# EAGLE design dw-probe-v1.0 (EAGLE 9.5.1)
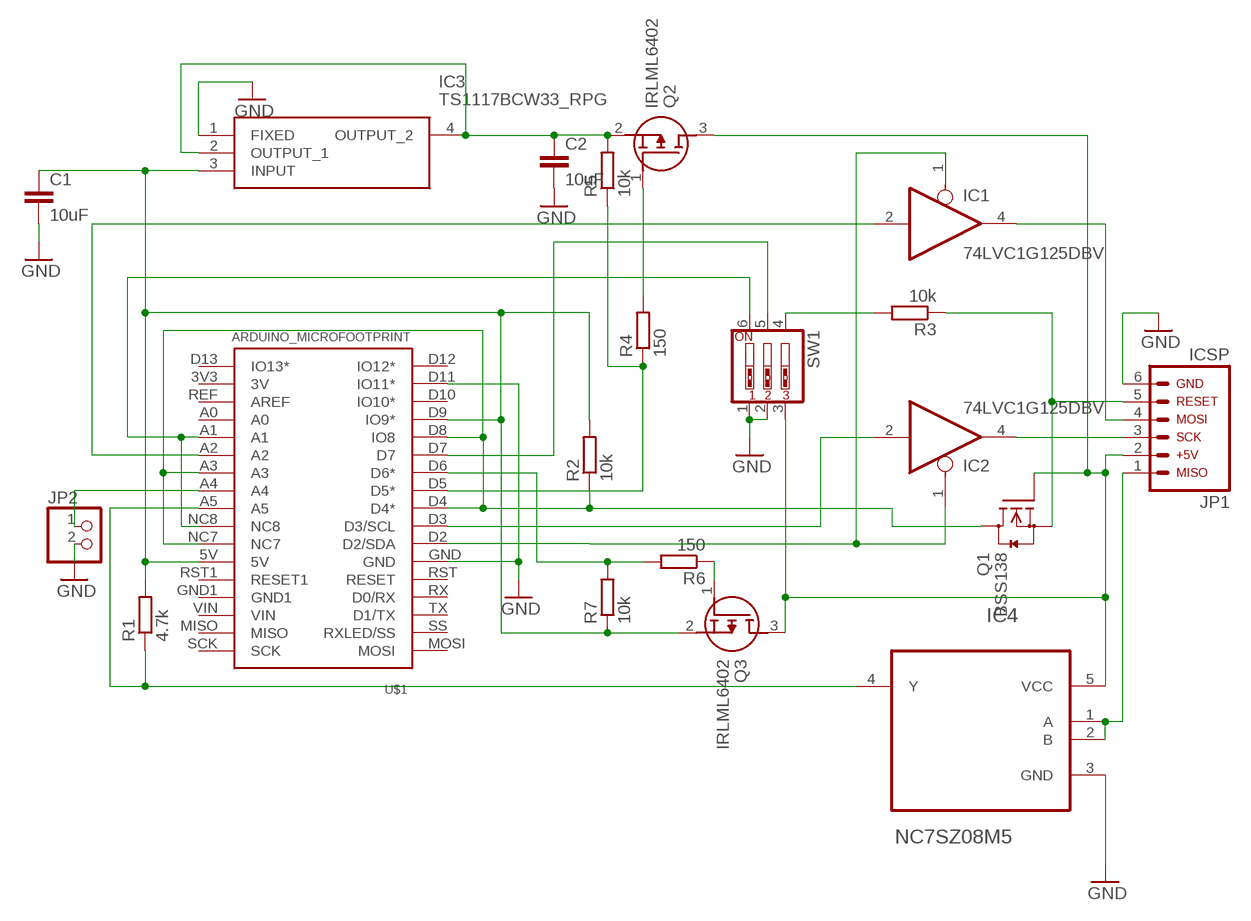
[diagram p0: schematic, sheet 1]

## Parts
C1  10uF  C-EUC0805  [C0805]
C2  10uF  C-EUC0805  [C0805]
IC1  74LVC1G125DBV  [SOT23-5]
IC2  74LVC1G125DBV  [SOT23-5]
IC3  TS1117BCW33_RPG  [SOT230P700X190-4N]
IC4  NC7SZ08M5  [SOT95P280X145-5N]
JP1  ARDUINO_CONN-ICSP  [CONN-2X03]
JP2  PINHD-1X2  [1X02]
Q1  BSS138  [SOT23]
Q2  IRLML6402  [SOT95P237X112-3N]
Q3  IRLML6402  [SOT95P237X112-3N]
R1  4.7k  R-EU_R0805  [R0805]
R2  10k  R-EU_R0805  [R0805]
R3  10k  R-EU_R0805  [R0805]
R4  150  R-EU_R0805  [R0805]
R5  10k  R-EU_R0805  [R0805]
R6  150  R-EU_R0805  [R0805]
R7  10k  R-EU_R0805  [R0805]
SW1  SW_DIP-3  [EDG-03]
U$1  ARDUINO_MICROFOOTPRINT  [ARDUINO-MICRO]

## Nets
GND: C1.2 C2.2 IC3.1(FIXED) IC4.3(GND) JP1.6 JP2.2 SW1.1 SW1.2 U$1.D11(IO11*) U$1.GND
N$1: R3.2 SW1.4
N$2: SW1.6 U$1.A1 U$1.NC8
N$3: IC1.1(OE) IC2.1(OE) U$1.D2(D2/SDA)
N$4: Q1.3(D) R2.1 U$1.A3 U$1.D4(D4*) U$1.D8(IO8) U$1.NC7
N$5: C1.1 IC3.3(INPUT) Q3.2(S) R1.2 R2.2 R7.1 U$1.5V U$1.D9(IO9*)
N$6: IC2.2(I) U$1.D3(D3/SCL)
N$7: IC1.2(I) U$1.A2
N$8: IC4.4(Y) R1.1 U$1.A5
N$9: JP2.1 U$1.A4
N$10: IC1.4(O) JP1.4
N$11: SW1.5 U$1.D7
N$12: IC4.5(VCC) JP1.2 Q1.1(G) Q2.3(D) Q3.3(D) SW1.3
N$13: IC4.1(A) IC4.2(B) JP1.1
N$14: JP1.5 Q1.2(S) R3.1
N$15: Q3.1(G) R6.1
N$16: C2.1 IC3.2(OUTPUT_1) IC3.4(OUTPUT_2) Q2.2(S) R5.2
N$17: IC2.4(O) JP1.3
N$18: R4.1 R5.1 U$1.D5(D5*)
N$19: Q2.1(G) R4.2
N$20: R6.2 R7.2 U$1.D6(D6*)
Unconnected: U$1.3V3(3V) U$1.A0 U$1.D10(IO10*) U$1.D12(IO12*) U$1.D13(IO13*) U$1.GND1 U$1.MISO U$1.MOSI U$1.REF(AREF) U$1.RST1(RESET1) U$1.RST(RESET) U$1.RX(D0/RX) U$1.SCK U$1.SS(RXLED/SS) U$1.TX(D1/TX) U$1.VIN

## Power pins joined to a net without a drawn wire
GND: IC1.3(GND) IC2.3(GND)
VCC: IC1.5(VCC) IC2.5(VCC)

## Library data of the parts
C1 C2 = rcl:C-EU: CAPACITOR, European symbol; SPICEPREFIX: C
IC1 IC2 = 74xx-little-us:74*1G125: Single Bus Buffer Gate with 3-State Output
IC3 = TS1117BCW33_RPG:TS1117BCW33_RPG: Taiwan Semiconductor TS1117BCW33 RPG, LDO Regulator, 800mA, 3.3 V, +/-2% 4-Pin, SOT-223 Source: Datasheet <http://uk.rs-online.com/web/p/products/1698939>; ARROW_PART_NUMBER: TS1117BCW33 RPG; ARROW_PRICE-STOCK: https://www.arrow.com/en/products/ts1117bcw33rpg/taiwan-semiconductor; DESCRIPTION: Taiwan Semiconductor TS1117BCW33 RPG, LDO Regulator, 800mA, 3.3 V, +/-2% 4-Pin, SOT-223; HEIGHT: 1.9mm; MANUFACTURER_NAME: Taiwan Semiconductor; MANUFACTURER_PART_NUMBER: TS1117BCW33 RPG; MOUSER_PART_NUMBER: 821-TS1117BCW33RPG; MOUSER_PRICE-STOCK: https://www.mouser.co.uk/ProductDetail/Taiwan-Semiconductor/TS1117BCW33-RPG?qs=5aG0NVq1C4zdwcJSPRwZGg%3D%3D
IC4 = NC7SZ08M5:NC7SZ08M5: Tiny logic UHS Two-Input AND Gate Check prices <https://pricing.snapeda.com/parts/NC7SZ08M5/ON%20Semiconductor/view-part?ref=eda>; AVAILABILITY: In Stock; DESCRIPTION: AND Gate IC 1 Channel - SOT-23-5; MF: ON Semiconductor; MP: NC7SZ08M5; PACKAGE: SOT-23 Fairchild Semiconductor; PRICE: None
JP1 = arduino_jw:ARDUINO_CONN-ICSP: Arduino ICSP I/O Header This is the ICSP I/O header on the Arduino Uno R3. This connector is labeled with the following pin assignments: MISO +5V SCK MOSI RESET GND NOTE: Be sure you install this connector with the correct orientation on your PCB layout. Pin 1 has a square pad to assist with orientation.
JP2 = pinhead:PINHD-1X2: PIN HEADER
Q1 = m-pad-2.1:BSS138: Fairchild Semiconductors BSS138 N-Channel Logic Level Enhancement Mode Field Effect Transistor General Description: These N-Channel enhancement mode field effect transistors are produced using Fairchild's proprietary, high cell density, DMOS technology. These products have been designed to minimize on-state resistance while provide rugged, reliable, and fast switching performance.These products are particularly suited for low voltage, low current applications such as small servo motor control, power MOSFET gate drivers, and other switching applications. Features: 0.22 A, 50 V. RDS(ON) = 3.5Ohm @ VGS = 10 V RDS(ON) = 6.0Ohm @ VGS = 4.5 V High density cell design for extremely low RDS(ON) Rugged and Reliable Compact industry standard SOT-23 surface mount package Please send any comments to: messi@users.sourceforge.net
Q2 Q3 = IRLML6402:IRLML6402: P-Channel MOSFET Transistor, 3.7 A, 20 V, 3-Pin SOT-23 International Rectifier IRLML6402 Source: Datasheet <https://datasheetspdf.com/pdf/513015/InternationalRectifier/IRLML6402/1>; DESCRIPTION: P-Channel MOSFET Transistor, 3.7 A, 20 V, 3-Pin SOT-23 International Rectifier IRLML6402; HEIGHT: 1.12mm; MANUFACTURER_NAME: Infineon; MANUFACTURER_PART_NUMBER: IRLML6402; MOUSER_PART_NUMBER: N/A; MOUSER_PRICE-STOCK: https://www.mouser.co.uk/ProductDetail/Infineon-IR/IRLML6402/?qs=Gkr2N%2F2q3o277qI%252BRzUP%252Bw%3D%3D
R1-R7 = rcl:R-EU_: RESISTOR, European symbol; SPICEPREFIX: R
SW1 = special:SW_DIP-3: DIP SWITCH
U$1 = arduino-micro:ARDUINO_MICRO

## Board
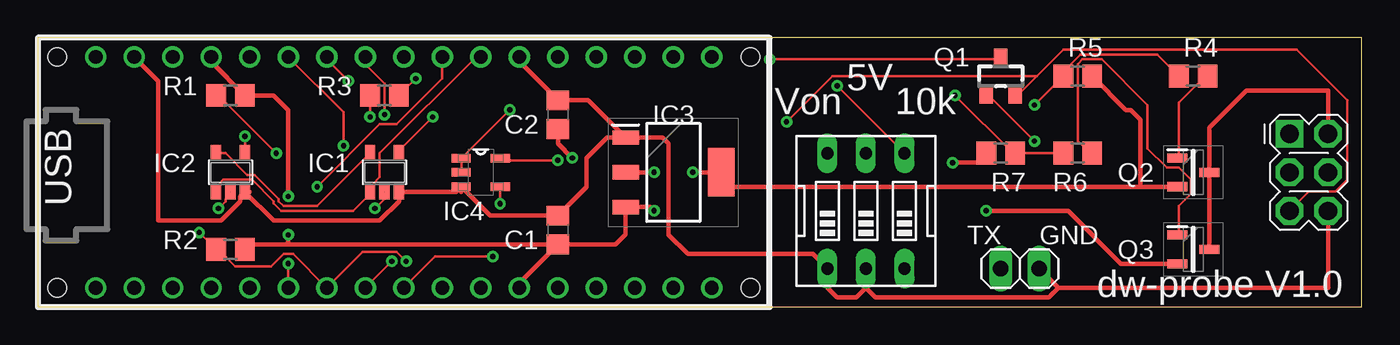
[diagram p1: board, top side]
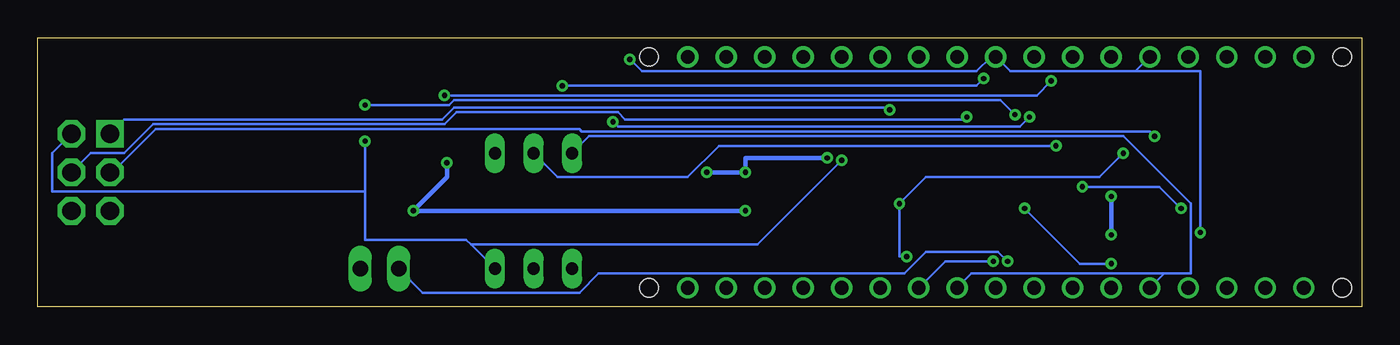
[diagram p2: board, bottom side, seen from below]

Size 87.3 x 17.77 mm. Coordinates in mm from the lower left corner, seen from the top.
Outline: 0,0 87.3,0 87.3,17.77 0,17.77 0,0
Copper layers (1*16): Top 0.035mm / dielectric 1.5mm / Bottom 0.035mm
Design rules "default *": minimum track width 6mil, minimum drill 0.35mm, track to track 6mil, track to pad 6mil, pad to pad 6mil, via to via 6mil, smd to smd 6mil, copper to edge 10mil, drill to drill 6mil, minimum pad ring 10mil, minimum via ring 8mil, stop-mask expansion 4mil, vias tented up to drill 0mil, thermal gap 10mil

### Footprints (pad centres in the part's own frame; a part is rotated, then mirrored left to right if it is on the bottom)
C0805 = smd 1.3 x 1.5: 1 -0.95,0; 2 0.95,0
SOT23-5 = smd 0.69 x 0.99: 1 -0.95,-1.29; 2 0,-1.29; 3 0.95,-1.29; 4 0.95,1.3; 5 -0.95,1.3
SOT230P700X190-4N = smd 1.75 x 0.95: 1 -3.15,2.3; 2 -3.15,0; 3 -3.15,-2.3 | smd 1.75 x 3.2: 4 3.15,0
SOT95P280X145-5N = smd 1.27 x 0.559: 1 -1.295,0.94; 2 -1.295,0; 3 -1.295,-0.94; 4 1.295,-0.94; 5 1.295,0.94
CONN-2X03 = drill 1.2 pad 1.829 square: 1 0,0 | drill 1.2 pad 1.829 octagon: 2 2.54,0; 3 0,-2.54; 4 2.54,-2.54; 5 0,-5.08; 6 2.54,-5.08
1X02 = drill 1.016 long: 1 -1.27,0; 2 1.27,0
SOT23 = smd 0.9 x 1.2: 1 -0.95,-1.2; 2 0.95,-1.2; 3 0,1.2
SOT95P237X112-3N = smd 1.3 x 0.6: 1 -1.05,0.95; 2 -1.05,-0.95; 3 1.05,0
R0805 = smd 1.3 x 1.5: 1 -0.95,0; 2 0.95,0
EDG-03 = drill 0.813 long: 1 -2.54,-3.81; 2 0,-3.81; 3 2.54,-3.81; 4 2.54,3.81; 5 0,3.81; 6 -2.54,3.81
ARDUINO-MICRO = drill 0.9: 3V3 16.51,3.81; 5V 16.51,29.21; A0 16.51,8.89; A1 16.51,11.43; A2 16.51,13.97; A3 16.51,16.51; A4 16.51,19.05; A5 16.51,21.59; D2 1.27,26.67; D3 1.27,24.13; D4 1.27,21.59; D5 1.27,19.05; D6 1.27,16.51; D7 1.27,13.97; D8 1.27,11.43; D9 1.27,8.89; D10 1.27,6.35; D11 1.27,3.81; D12 1.27,1.27; D13 16.51,1.27; GND 1.27,29.21; GND1 16.51,34.29; MISO 16.51,39.37; MOSI 1.27,41.91; NC7 16.51,26.67; NC8 16.51,24.13; REF 16.51,6.35; RST 1.27,31.75; RST1 16.51,31.75; RX 1.27,34.29; SCK 16.51,41.91; SS 1.27,39.37; TX 1.27,36.83; VIN 16.51,36.83 | hole 1.2: 1.27,-1.27; 16.51,-1.27; 1.27,44.45; 16.51,44.45

### Placement (x,y rotation side)
C1  34.29,5.08 90 top
C2  34.29,12.7 90 top
IC1  22.86,8.89 0 top
IC2  12.7,8.89 0 top
IC3  41.91,8.89 0 top
IC4  29.21,8.89 0 top
JP1  82.55,11.43 0 top
JP2  64.77,2.54 0 top
Q1  63.5,15.24 0 top
Q2  76.2,8.89 0 top
Q3  76.2,3.81 0 top
R1  12.7,13.97 0 top
R2  12.7,3.81 0 top
R3  22.86,13.97 0 top
R4  76.2,15.24 0 top
R5  68.58,15.24 0 top
R6  68.58,10.16 180 top
R7  63.5,10.16 0 top
SW1  54.61,6.35 0 top
U$1  2.54,17.78 270 top

### Tracks (layer width: path | path; a pad name or v marks a point on that pad's centre or on a via)
GND
  Top 0.305: 13.97,7.6 IC2.3 | IC2.3 15.54,5.71 22.54,5.71 23.81,6.98 IC1.3 | IC1.3 24.13,7.6 | 27.91,7.6 27.91,7.62 IC4.3 | C1.2 34.29,5.71 | IC3.1 38.76,11.43 IC3.1 | JP1.6 85.09,1.27 67.31,1.27 | JP2.2 67.31,1.27 | 67.31,1.27 66.67,0.64 55.24,0.64 54.61,1.27 | 54.61,1.27 SW1.2 54.61,1.27 | 54.61,1.27 53.98,0.64 52.7,0.64 52.07,1.27 SW1.1 51.12,3.49 42.86,3.49 41.59,4.76 41.59,10.79 41.2,11.19 IC3.1 | U$1.D11 7.94,14.92 7.94,5.71 12.09,5.71 13.35,6.98 13.35,7.3 IC2.3 | IC1.3 27.56,7.6 IC4.3 | IC4.3 29.84,6.03 C1.2 | C1.2 36.2,7.93 36.2,9.84 37.54,11.19 IC3.1 | IC3.1 36.3,13.65 C2.2 31.75,16.19 U$1.GND
N$1  (via drill 0.35)
  Top 0.152: v24.92,15.08 R3.2 | SW1.4 v52.7,14.61
  Bottom 0.152: v24.92,15.08 25.4,14.61 v52.7,14.61
N$2
  Bottom 0.152: SW1.6 50.96,11.27 15.72,11.27 11.27,6.83 11.27,2.22 13.02,2.22 | U$1.A1 13.02,2.22 | U$1.NC8 25.72,2.22 13.02,2.22
N$3
  Top 0.152: IC2.1 11.91,7.62 11.91,8.1 12.22,8.41 14.13,8.41 15.56,6.99 15.56,6.83 16.03,6.35 20.8,6.35 21.91,7.46 IC1.1 22.07,7.62 22.07,8.1 22.54,8.57 22.54,10.16 28.89,16.51 U$1.D2
N$4  (via drill 0.35)
  Top 0.152: v24.29,3.02 23.65,3.65 21.43,3.65 U$1.A3 16.83,3.49 16.19,3.49 15.4,2.7 13.02,2.7 11.91,3.81 R2.1 v10.64,4.92 | v48.26,16.35 63.5,16.35 Q1.3
  Bottom 0.152: U$1.NC7 27.46,3.02 v24.29,3.02 | v48.26,16.35 47.47,15.56 25.4,15.56 24.45,16.51 U$1.D4 23.18,15.56 14.92,15.56 | 14.92,15.56 U$1.D8 | v10.64,4.92 10.64,15.56 14.92,15.56
N$5  (via drill 0.35)
  Top 0.305: C1.1 38.1,4.13 38.76,4.79 IC3.3 40.4,6.59 v40.64,6.35 | C1.1 16.51,4.13 | 16.51,4.13 14.29,4.13 C1.1 | U$1.5V 31.75,1.59 C1.1 | U$1.D9 11.43,16.19 R1.2 15.56,13.97 16.51,13.02 v16.51,7.3 | 16.51,4.13 v16.51,4.76 | R2.2 13.97,4.13 16.51,4.13 | Q3.2 71.44,2.86 67.94,6.35 v62.55,6.35 | R7.1 61.91,9.53 v60.33,9.53
  Bottom 0.305: v16.51,7.3 v16.51,4.76 | v40.64,6.35 v62.55,6.35 60.33,8.57 v60.33,9.53
N$6  (via drill 0.35)
  Top 0.152: v11.91,6.51 12.38,6.99 12.38,7.14 12.7,7.46 IC2.2 | v18.41,7.94 22.54,12.06 23.65,12.06 26.67,15.08 U$1.D3
  Bottom 0.152: v11.91,6.51 13.34,7.94 v18.41,7.94
N$7  (via drill 0.35)
  Top 0.152: v22.23,6.51 22.86,7.14 22.86,7.46 IC1.2 | U$1.A2 v16.51,2.86
  Bottom 0.152: v22.23,6.51 18.57,2.86 v16.51,2.86
N$8  (via drill 0.35)
  Top 0.152: v30.48,6.83 30.48,7.94 IC4.4 | v30,3.33 26.19,3.33 U$1.A5 | v15.72,10.16 11.91,13.97 R1.1
  Bottom 0.152: v30,3.33 30.48,3.33 v30.48,6.83 28.73,8.57 17.3,8.57 v15.72,10.16
N$9  (via drill 0.35)
  Top 0.152: v23.34,3.02 U$1.A4
  Bottom 0.152: v23.34,3.02 23.97,3.65 28.73,3.65 30.16,2.22 50.32,2.22 51.59,0.95 61.91,0.95 JP2.1
N$10  (via drill 0.35)
  Top 0.152: v26.04,12.54 23.81,10.32 IC1.4
  Bottom 0.152: v26.04,12.54 26.19,12.38 48.58,12.38 49.05,12.86 59.69,12.86 60.48,12.06 79.69,12.06 81.6,10.16 83.82,10.16 JP1.4
N$11  (via drill 0.35)
  Top 0.152: v20.16,10.64 20.16,12.86 U$1.D7
  Bottom 0.152: SW1.5 53.02,8.57 44.45,8.57 42.39,10.64 v20.16,10.64
N$12  (via drill 0.35)
  Top 0.152: v65.72,10.95 62.71,13.97 Q1.1 | v34.29,9.68 30.64,9.68 IC4.5
  Top 0.305: JP1.2 85.09,14.29 79.69,14.29 77.25,11.85 Q2.3 Q3.3
  Bottom 0.152: 65.72,7.62 65.72,4.45 59.05,4.45 58.74,4.13 | 65.72,7.62 v65.72,10.95 | SW1.3 58.74,4.13 | v34.29,9.68 39.85,4.13 58.74,4.13 | JP1.2 86.36,10.16 86.36,7.62 65.72,7.62
N$13  (via drill 0.35)
  Top 0.152: IC4.2 27.94,8.89 27.94,9.68 IC4.1 27.94,9.84 v31.11,13.02
  Bottom 0.152: v31.11,13.02 31.27,13.18 59.85,13.18 60.64,12.38 81.6,12.38 JP1.1
N$14  (via drill 0.35)
  Top 0.152: 65.88,15.24 67.63,16.99 83.03,16.99 86.36,13.65 86.36,8.41 85.57,7.62 83.82,7.62 JP1.5 | 65.88,15.24 64.77,14.13 64.45,14.13 Q1.2 | v21.91,12.54 R3.1 | v49.37,12.22 52.39,15.24 65.88,15.24
  Bottom 0.152: v21.91,12.54 22.54,11.91 49.05,11.91 v49.37,12.22
N$15
  Top 0.152: Q3.1 75.25,4.76 75.25,6.67 76.04,7.46 76.04,8.41 75.25,9.21 74.45,9.21 73.18,10.48 73.18,13.34 70.17,16.35 68.9,16.35 68.58,16.03 68.58,10.95 69.37,10.16 R6.1
N$16  (via drill 0.35)
  Top 0.152: IC3.4 45.09,8.89 45.09,7.94 45.1,7.94
  Top 0.305: Q2.2 72.71,7.94 | 72.71,7.94 45.41,7.94 45.4,7.94 45.1,7.94 | R5.2 71.75,13.02 72.07,13.02 72.71,12.38 72.71,7.94 | IC3.4 v43.18,8.89 | v40.64,8.89 IC3.2 | v35.24,9.84 34.29,10.79 C2.1
  Bottom 0.305: v43.18,8.89 v40.64,8.89 40.64,9.84 v35.24,9.84
N$17  (via drill 0.35)
  Top 0.152: v13.65,11.27 13.65,10.32 IC2.4
  Bottom 0.152: v13.65,11.27 13.97,11.59 51.44,11.59 51.59,11.75 79.53,11.75 82.39,8.89 JP1.3
N$18  (via drill 0.35)
  Top 0.152: R4.1 73.82,16.67 68.74,16.67 67.79,15.72 67.79,15.24 R5.1 v65.72,13.34 | U$1.D5 21.59,16.03 22.86,14.76 v22.86,12.7
  Bottom 0.152: v22.86,12.7 23.81,13.65 59.85,13.65 60.17,13.34 v65.72,13.34
N$19
  Top 0.152: Q2.1 75.25,9.84 75.25,13.49 76.99,15.24 R4.2
N$20  (via drill 0.35)
  Top 0.152: R6.2 R7.2 64.29,10.16 v60.48,13.97 | v20.48,14.92 19.05,16.35 U$1.D6
  Bottom 0.152: v60.48,13.97 21.43,13.97 v20.48,14.92
VCC
  Top 0.152: IC2.5 11.91,10.16 12.38,10.16 13.81,8.73 14.29,8.73 15.88,7.14 15.88,6.99 16.19,6.67 18.41,6.67 21.91,10.16 IC1.5

### Text on the board
tNames: 5V | Von | 10k | USB | TX | GND | dw-probe V1.0